# EAGLE design MaxMotornRF52840 (EAGLE 7.7.0)

## Sheet 1 of 2
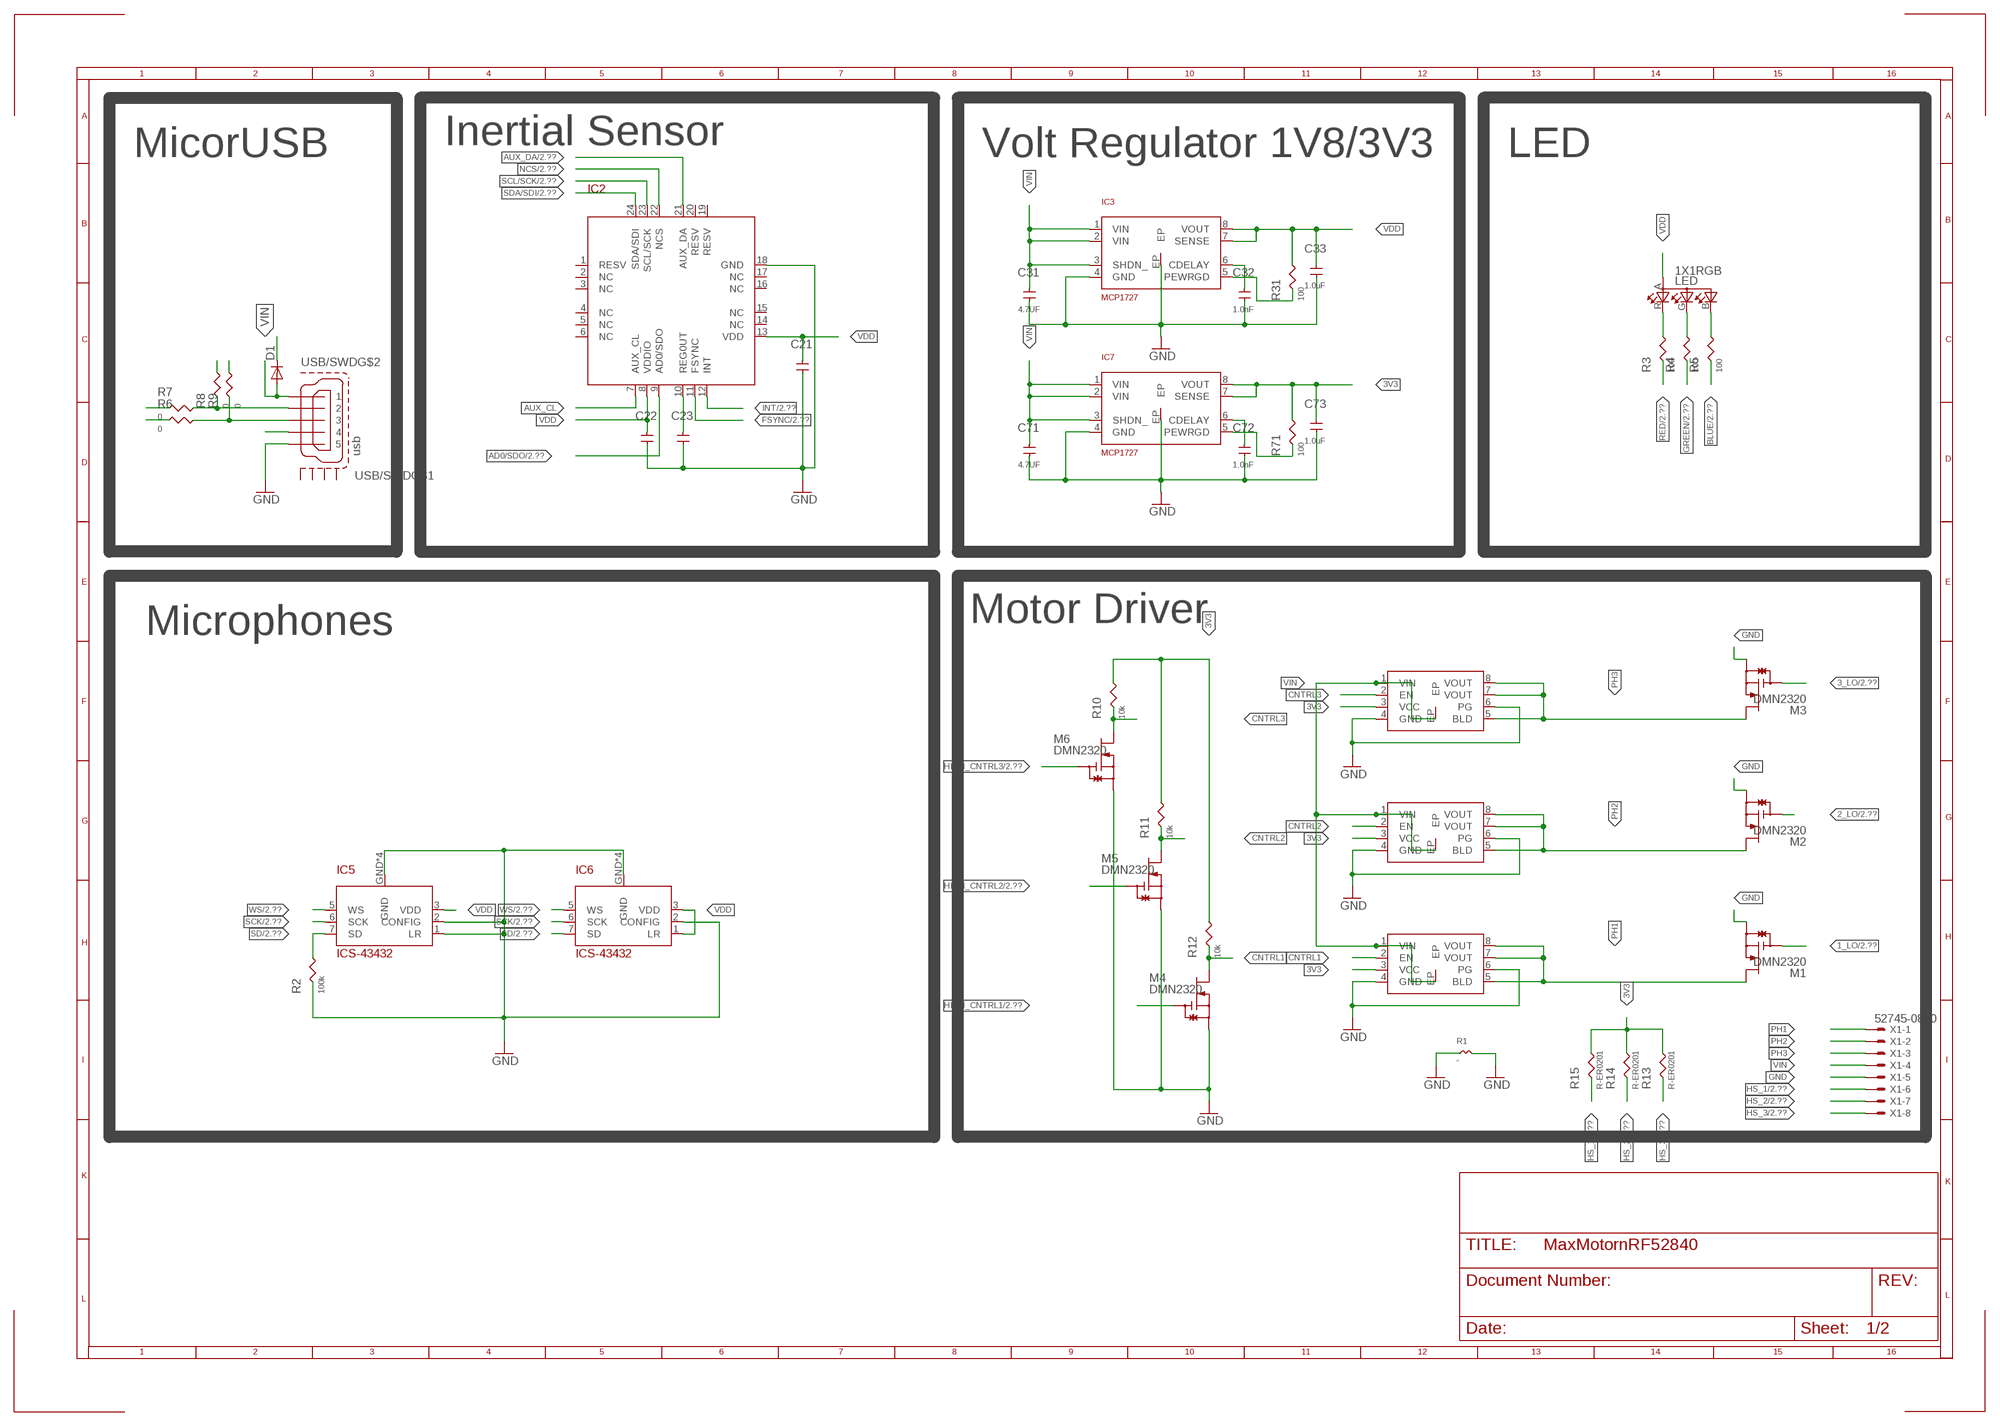
[diagram p0: schematic, sheet 1]

### Parts
C21  C-ER201  [C0201]
C22  C-ER201  [C0201]
C23  C-ER201  [C0201]
C31  4.7UF  C-ERC0402  [C0402]
C32  1.0nF  C-ER201  [C0201]
C33  1.0uF  C-ER201  [C0201]
C71  4.7UF  C-ERC0402  [C0402]
C72  1.0nF  C-ER201  [C0201]
C73  1.0uF  C-ER201  [C0201]
D1  DIODE-SOD123  [SOD123]
IC2  ICM20948  [3X3_24_QFN_CORRECTED]
IC3  MCP1727  [DFN8-3X3]
IC5  ICS-43432  [ICS-43432]
IC6  ICS-43432  [ICS-43432]
IC7  MCP1727  [DFN8-3X3]
LED  1X1RGB  [1X1]
M1  DMN2320  [AP02002]
M2  DMN2320  [AP02002]
M3  DMN2320  [AP02002]
M4  DMN2320  [AP02002]
M5  DMN2320  [AP02002]
M6  DMN2320  [AP02002]
M7  NCP45524/25  [DFN8]
M8  NCP45524/25  [DFN8]
M9  NCP45524/25  [DFN8]
R1  0  R-ER-TINY  [R0805]
R2  100k  R-ER0201  [R0201]
R3  100  R-ER0201  [R0201]
R4  100  R-ER0201  [R0201]
R5  100  R-ER0201  [R0201]
R6  0  R-ER0201  [R0201]
R7  0  R-ER0201  [R0201]
R8  0  R-ER0201  [R0201]
R9  0  R-ER0201  [R0201]
R10  10k  R-ER0201  [R0201]
R11  10k  R-ER0201  [R0201]
R12  10k  R-ER0201  [R0201]
R13  R-ER0201  [R0201]
R14  R-ER0201  [R0201]
R15  R-ER0201  [R0201]
R31  100  R-ER0201  [R0201]
R71  100  R-ER0201  [R0201]
USB/SWD  usb  MICRO-USB-SHIELD-ZX62R-B-5P  [ZX62R-B-5P]
X1  52745-0890  [52745-0890]

### Nets
1_LO: M1.G ; also sheet 2
2_LO: M2.G ; also sheet 2
3_LO: M3.G ; also sheet 2
3V3: C73.2 IC7.7(SENSE) IC7.8(VOUT) M7.3(VCC) M8.3(VCC) M9.3(VCC) R10.2 R11.2 R12.2 R13.2 R14.2 R15.2 R71.2
AD0/SDO: IC2.9(AD0/SDO) ; also sheet 2
AUX_CL: IC2.7(AUX_CL)
AUX_DA: IC2.21(AUX_DA) ; also sheet 2
BLUE: R5.1 ; also sheet 2
CNTRL1: M4.D M7.2(EN) R12.1
CNTRL2: M5.D M8.2(EN) R11.1
CNTRL3: M6.D M9.2(EN) R10.1
D+: R6.1 ; also sheet 2
D-: R7.1 ; also sheet 2
FSYNC: IC2.11(FSYNC) ; also sheet 2
GND: C21.1 C22.1 C23.1 C31.1 C32.1 C33.1 C71.1 C72.1 C73.1 IC2.18(GND) IC3.4(GND) IC3.EP IC5.1(LR) IC5.2(CONFIG) IC5.GND IC5.GND@1(GND) IC5.GND@2(GND) IC5.GND@(GND) IC6.2(CONFIG) IC6.GND IC6.GND@1(GND) IC6.GND@2(GND) IC6.GND@(GND) IC7.4(GND) IC7.EP M1.S M2.S M3.S M4.S M5.S M6.S M7.4(GND) M7.6(PG) M8.4(GND) M8.6(PG) M9.4(GND) M9.6(PG) R1.1 R1.2 R2.1 USB/SWD.1 X1.5 ; also sheet 2
GREEN: R4.1 ; also sheet 2
HIGH_CNTRL1: M4.G ; also sheet 2
HIGH_CNTRL2: M5.G ; also sheet 2
HIGH_CNTRL3: M6.G ; also sheet 2
HS_1: R15.1 X1.6 ; also sheet 2
HS_2: R14.1 X1.7 ; also sheet 2
HS_3: R13.1 X1.8 ; also sheet 2
INT: IC2.12(INT) ; also sheet 2
N$2: C23.2 IC2.10(REG0UT)
N$11: IC7.5(PEWRGD) R71.1
N$13: C72.2 IC7.6(CDELAY)
N$16: LED.B(CGREEN) R5.2
N$24: LED.G(CBLUE) R4.2
N$25: IC3.5(PEWRGD) R31.1
N$26: LED.R(CRED) R3.2
N$27: C32.2 IC3.6(CDELAY)
NCS: IC2.22(NCS) ; also sheet 2
PH1: M1.D M7.5(BLD) M7.7(VOUT) M7.8(VOUT) X1.1
PH2: M2.D M8.5(BLD) M8.7(VOUT) M8.8(VOUT) X1.2
PH3: M3.D M9.5(BLD) M9.7(VOUT) M9.8(VOUT) X1.3
RED: R3.1 ; also sheet 2
SCK: IC5.6(SCK) IC6.6(SCK) ; also sheet 2
SCL/SCK: IC2.23(SCL/SCK) ; also sheet 2
SD: IC5.7(SD) IC6.7(SD) R2.2 ; also sheet 2
SDA/SDI: IC2.24(SDA/SDI) ; also sheet 2
SWDCLK: R9.2 ; also sheet 2
SWDIO: R8.2 ; also sheet 2
USB2: R7.2 R8.1 USB/SWD.4
USB3: R6.2 R9.1 USB/SWD.3
USB4: USB/SWD.2
VBUS: D1.C ; also sheet 2
VDD: C21.2 C22.2 C33.2 IC2.8(VDDIO) IC2.13(VDD) IC3.7(SENSE) IC3.8(VOUT) IC5.3(VDD) IC6.1(LR) IC6.3(VDD) LED.A(A2) R31.2 ; also sheet 2
VIN: C31.2 C71.2 D1.A IC3.1(VIN) IC3.2(VIN) IC3.3(SHDN_) IC7.1(VIN) IC7.2(VIN) IC7.3(SHDN_) M7.1(VIN) M7.EP M8.1(VIN) M8.EP M9.1(VIN) M9.EP USB/SWD.5 X1.4
WS: IC5.5(WS) IC6.5(WS) ; also sheet 2
Unconnected: IC2.1(RESV) IC2.2(NC) IC2.3(NC) IC2.4(NC) IC2.5(NC) IC2.6(NC) IC2.14(NC) IC2.15(NC) IC2.16(NC) IC2.17(NC) IC2.19(RESV) IC2.20(RESV) USB/SWD.M1(S1) USB/SWD.M2(S2) USB/SWD.M3(S3) USB/SWD.M4(S4)

### Notes on the sheet
- MicorUSB | Inertial Sensor | Volt Regulator 1V8/3V3 | LED
- Microphones | Motor Driver

## Sheet 2 of 2
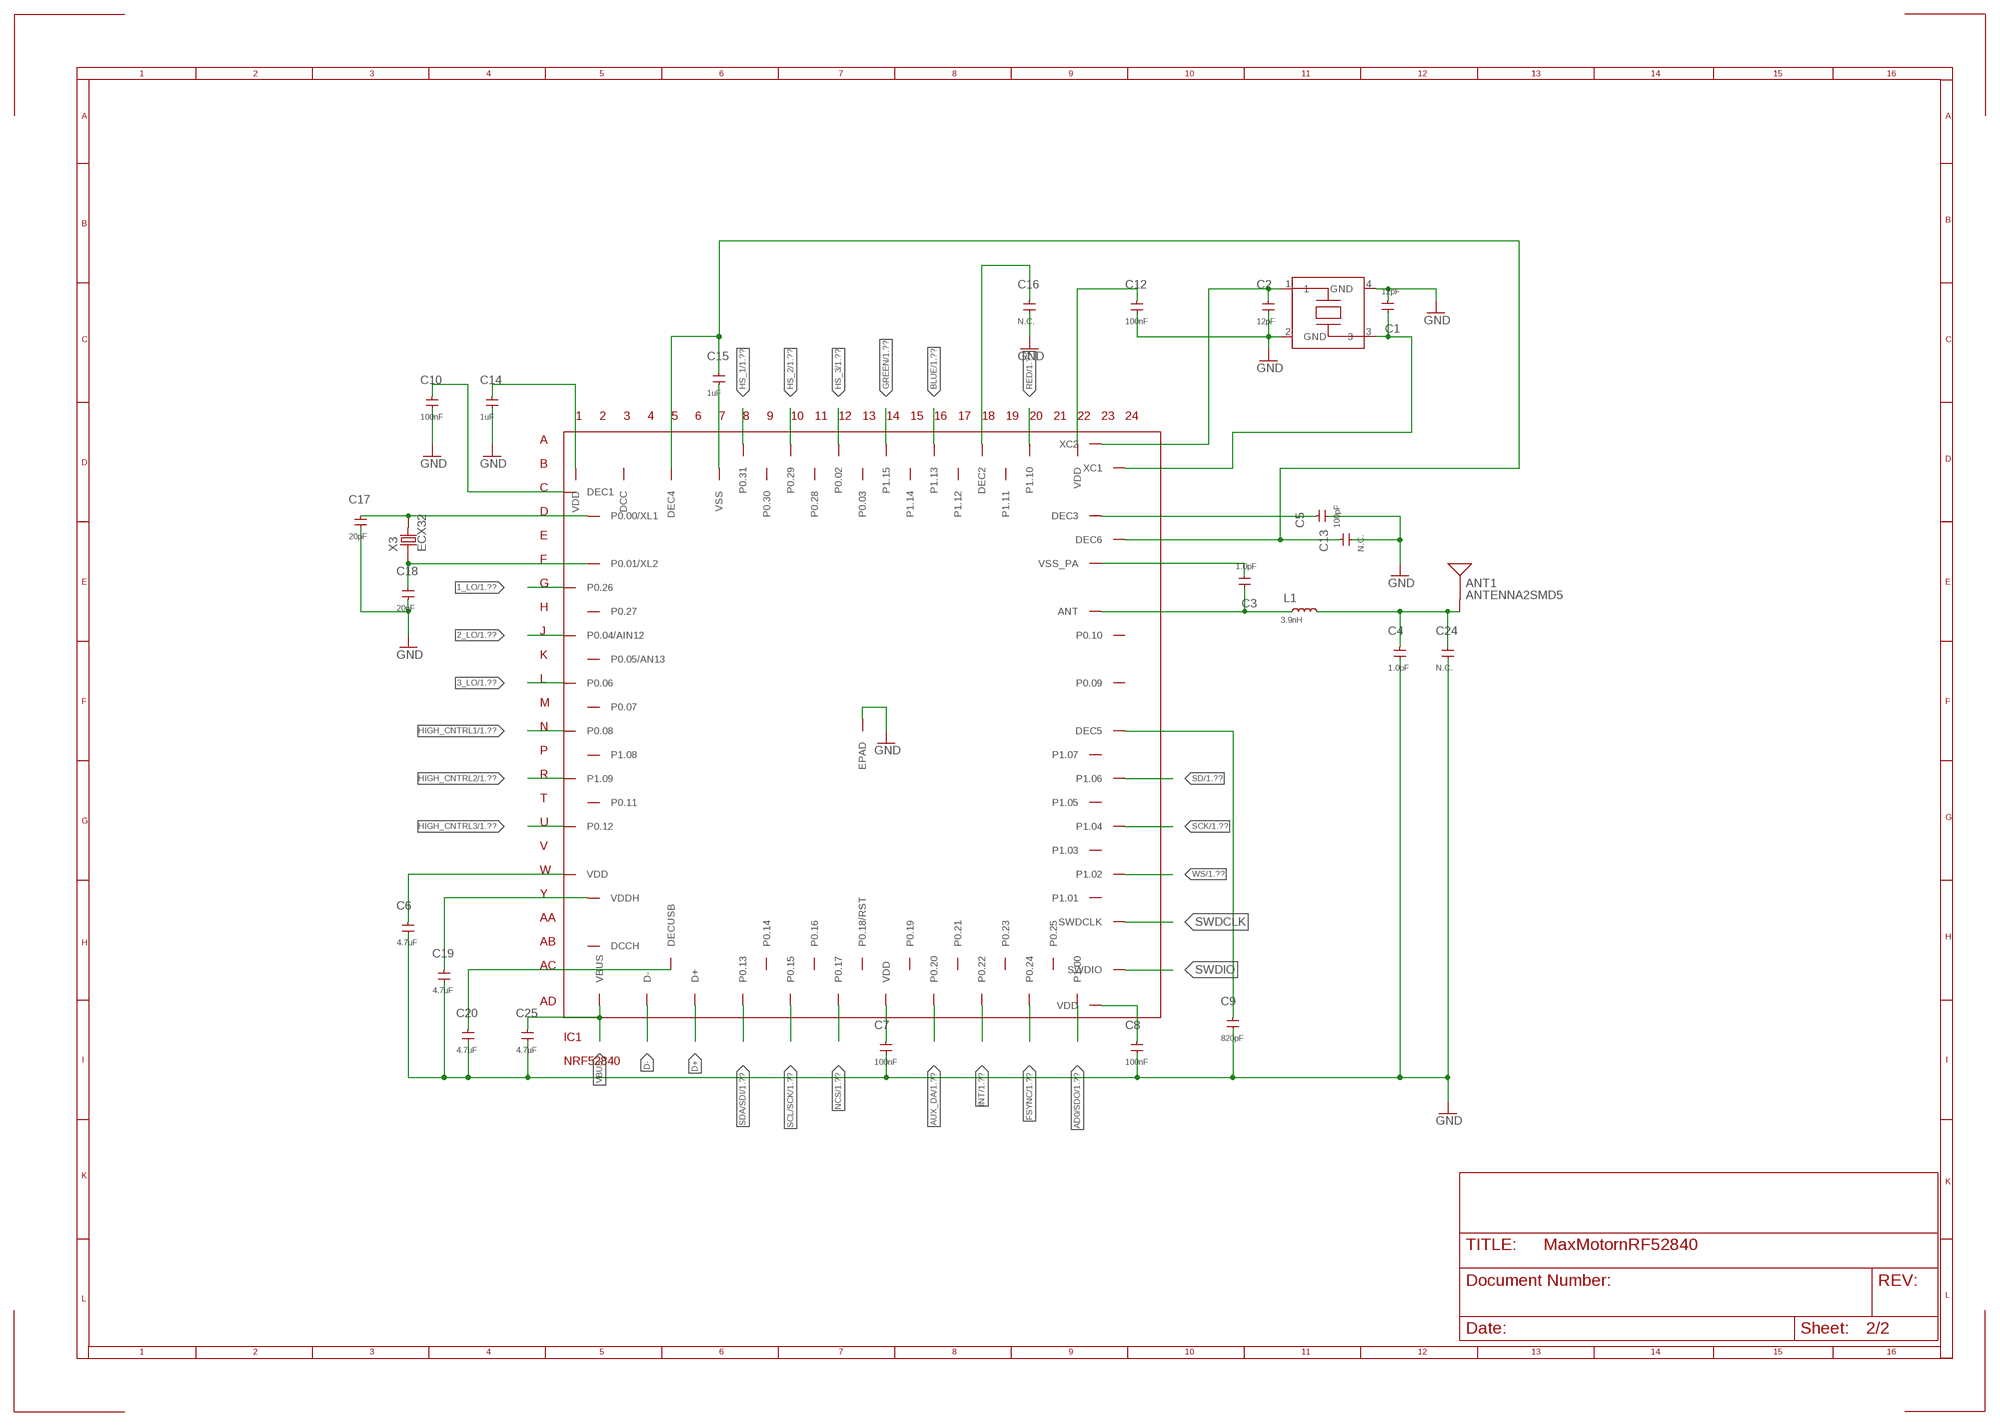
[diagram p1: schematic, sheet 2]

### Parts
ANT1  ANTENNA2SMD5  [ANTENNA-CHIP5]
C1  12pF  C-ER201  [C0201]
C2  12pF  C-ER201  [C0201]
C3  1.0pF  C-ER201  [C0201]
C4  1.0pF  C-ER201  [C0201]
C5  100pF  C-ER201  [C0201]
C6  4.7uF  C-ERC0402  [C0402]
C7  100nF  C-ER201  [C0201]
C8  100nF  C-ER201  [C0201]
C9  820pF  C-ER201  [C0201]
C10  100nF  C-ER201  [C0201]
C12  100nF  C-ER201  [C0201]
C13  N.C.  C-ER201  [C0201]
C14  1uF  C-ER201  [C0201]
C15  1uF  C-ER201  [C0201]
C16  N.C.  C-ER201  [C0201]
C17  20pF  C-ER201  [C0201]
C18  20pF  C-ER201  [C0201]
C19  4.7uF  C-ERC0402  [C0402]
C20  4.7uF  C-ERC0402  [C0402]
C24  N.C.  C-ER201  [C0201]
C25  4.7uF  C-ERC0402  [C0402]
IC1  NRF52840  [AQFN73]
L1  3.9nH  L-ER0201  [C0201@1]
X2  ABM12  [ABM12]
X3  ECX32  [ECX39]

### Nets
1_LO: IC1.G1(P0.26) ; also sheet 1
2_LO: IC1.J1(P0.04/AIN12) ; also sheet 1
3_LO: IC1.L1(P0.06) ; also sheet 1
AD0/SDO: IC1.AD22(P1.00) ; also sheet 1
AUX_DA: IC1.AD16(P0.20) ; also sheet 1
BLUE: IC1.A16(P1.13) ; also sheet 1
D+: IC1.AD6(D+) ; also sheet 1
D-: IC1.AD4(D-) ; also sheet 1
FSYNC: IC1.AD20(P0.24) ; also sheet 1
GND: C1.1 C2.1 C3.1 C4.1 C5.1 C6.1 C7.1 C8.1 C9.1 C10.1 C12.1 C13.1 C14.1 C15.1 C16.1 C17.1 C18.1 C19.1 C20.1 C24.1 C25.1 IC1.B7(VSS) IC1.EPAD IC1.F23(VSS_PA) X2.2(GND) X2.4(GND) ; also sheet 1
GREEN: IC1.A14(P1.15) ; also sheet 1
HIGH_CNTRL1: IC1.N1(P0.08) ; also sheet 1
HIGH_CNTRL2: IC1.R1(P1.09) ; also sheet 1
HIGH_CNTRL3: IC1.U1(P0.12) ; also sheet 1
HS_1: IC1.A8(P0.31) ; also sheet 1
HS_2: IC1.A10(P0.29) ; also sheet 1
HS_3: IC1.A12(P0.02) ; also sheet 1
INT: IC1.AD18(P0.22) ; also sheet 1
N$4: C20.2 IC1.AC5(DECUSB)
N$5: C13.2 C15.2 IC1.B5(DEC4) IC1.E24(DEC6)
N$6: C17.2 IC1.D2(P0.00/XL1) X3.P$2
N$7: C16.2 IC1.A18(DEC2)
N$8: C3.2 IC1.H23(ANT) L1.1
N$9: ANT1.FEED(SIGNAL) C4.2 C24.2 L1.2
N$12: C18.2 IC1.F2(P0.01/XL2) X3.P$1
N$15: C9.2 IC1.N24(DEC5)
N$17: C14.2 IC1.B1(VDD)
N$18: C5.2 IC1.D23(DEC3)
NCS: IC1.AD12(P0.17) ; also sheet 1
RED: IC1.A20(P1.10) ; also sheet 1
SCK: IC1.U24(P1.04) ; also sheet 1
SCL/SCK: IC1.AD10(P0.15) ; also sheet 1
SD: IC1.R24(P1.06) ; also sheet 1
SDA/SDI: IC1.AD8(P0.13) ; also sheet 1
SWDCLK: IC1.AA24(SWDCLK) ; also sheet 1
SWDIO: IC1.AC24(SWDIO) ; also sheet 1
VBUS: C19.2 C25.2 IC1.AD2(VBUS) IC1.Y2(VDDH) ; also sheet 1
VDD: C6.2 C7.2 C8.2 C10.2 C12.2 IC1.A22(VDD) IC1.AD14(VDD) IC1.AD23(VDD) IC1.C1(DEC1) IC1.W1(VDD) ; also sheet 1
WS: IC1.W24(P1.02) ; also sheet 1
XC1: C1.2 IC1.B24(XC1) X2.3
XC2: C2.2 IC1.A23(XC2) X2.1
Unconnected: IC1.AB2(DCCH) IC1.AC9(P0.14) IC1.AC11(P0.16) IC1.AC13(P0.18/RST) IC1.AC15(P0.19) IC1.AC17(P0.21) IC1.AC19(P0.23) IC1.AC21(P0.25) IC1.B3(DCC) IC1.B9(P0.30) IC1.B11(P0.28) IC1.B13(P0.03) IC1.B15(P1.14) IC1.B17(P1.12) IC1.B19(P1.11) IC1.H2(P0.27) IC1.J24(P0.10) IC1.K2(P0.05/AN13) IC1.L24(P0.09) IC1.M2(P0.07) IC1.P2(P1.08) IC1.P23(P1.07) IC1.T2(P0.11) IC1.T23(P1.05) IC1.V23(P1.03) IC1.Y23(P1.01)

## Library data of the parts
ANT1 = SparkFun:ANTENNA2: Antenna Single endded antenna. Common with smaller chip antennas. CHIP4 package is the GPS Chip Antenna SKU: GPS-08418. CHIP5 package is 2.4GHz chip antenna SKU: WRL-00144.
C1-C10 C12-C25 C31-C33 C71-C73 = rcl:C-ER
D1 = diode:DIODE-: DIODE
IC1 = Nordic:NRF52840
IC2 = invensense:ICM20948
IC3 IC7 = microchip:MCP1727
IC5 IC6 = invensense:ICS-43432
L1 = rcl:L-ER
LED = led:1X1RGB
M1-M6 = transistor-fet:DMN2320
M7-M9 = transistor-fet:NCP45524/25
R1 = rcl:R-ER-TINY
R2-R15 R31 R71 = rcl:R-ER
USB/SWD = con-hirose:MICRO-USB-SHIELD-: Hirose Micro USB Connector ZX62R-B-5P: Micro B, reverse (top mount) shell SMT Supplier: DigiKey H11574CT-ND Source: http://www.hirose.co.jp/cataloge_hp/e24200011.pdf
X1 = con-molex:52745-0890: FFC/FPC-to-Board 0.50mm (.020") SMT Top Contact Right Angle, ZIF, Style Receptacle 52745 / 52435 Source: http://www.molex.com/product/ffc/52745.html
X2 = crystal:ABM12; DIGIKEY: SER3800CT-ND
X3 = crystal:ECX32

## Board
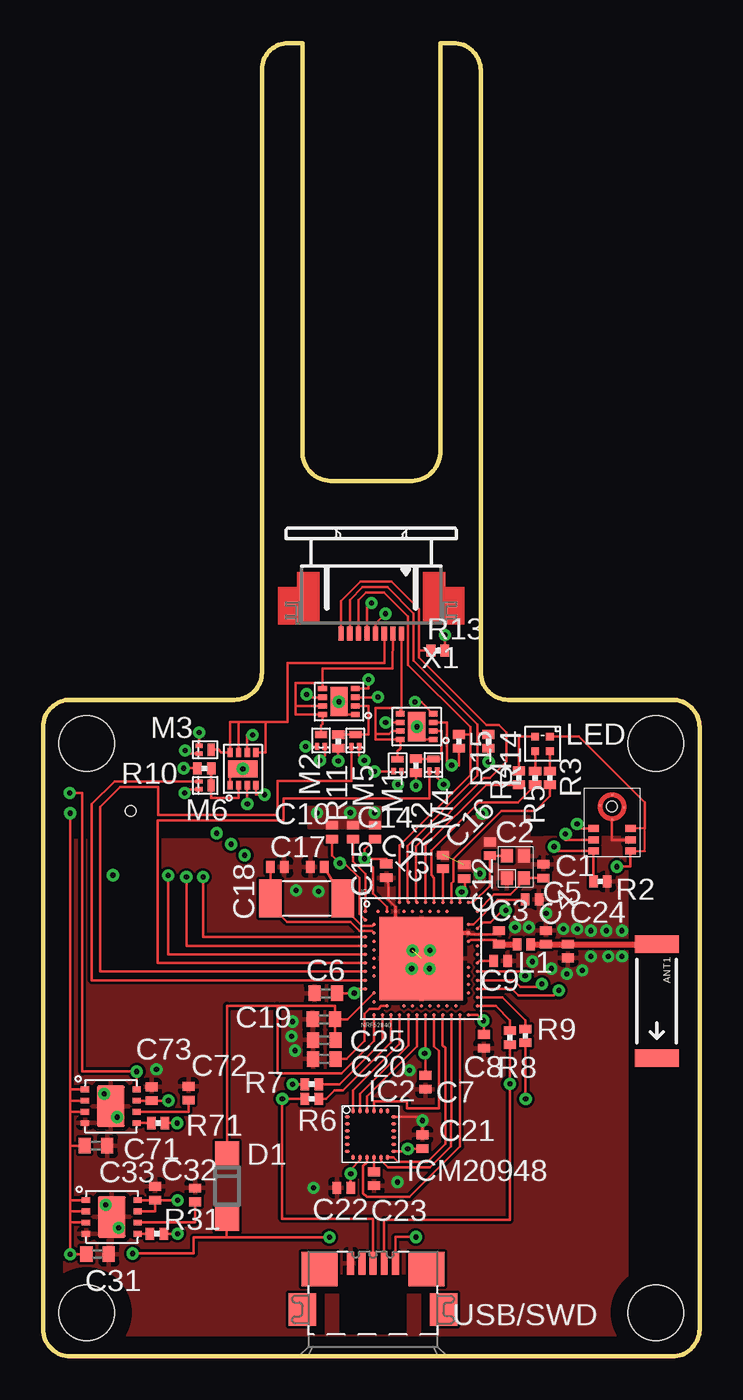
[diagram p2: board, top side]
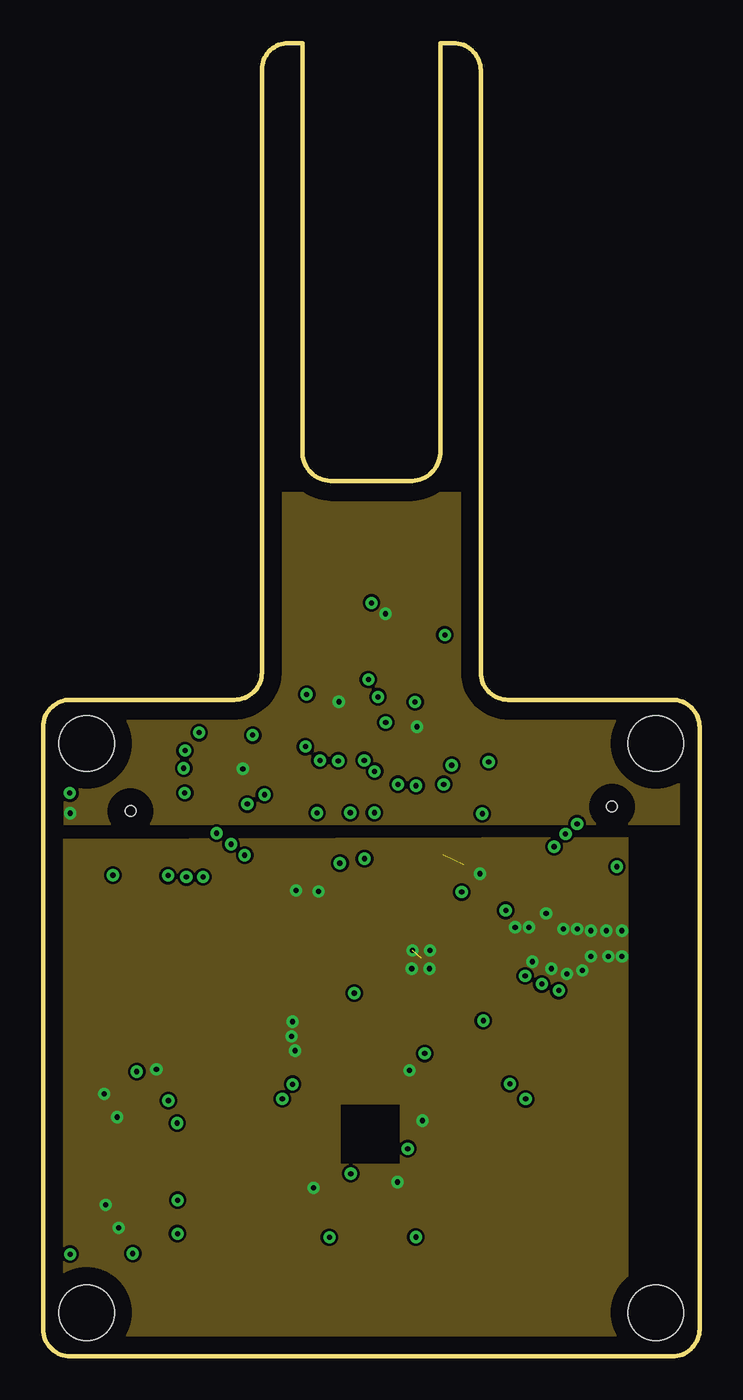
[diagram p3: board, inner layer Route2]
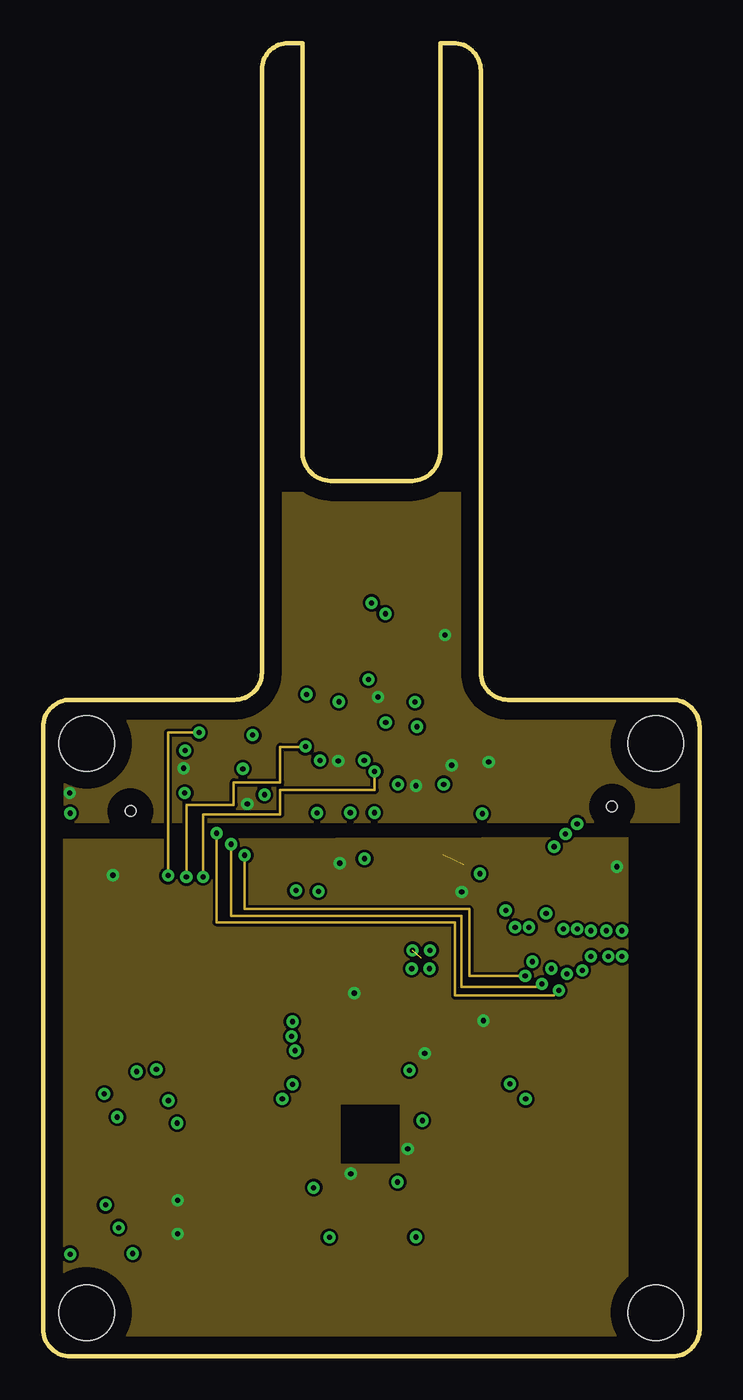
[diagram p4: board, inner layer Route3]
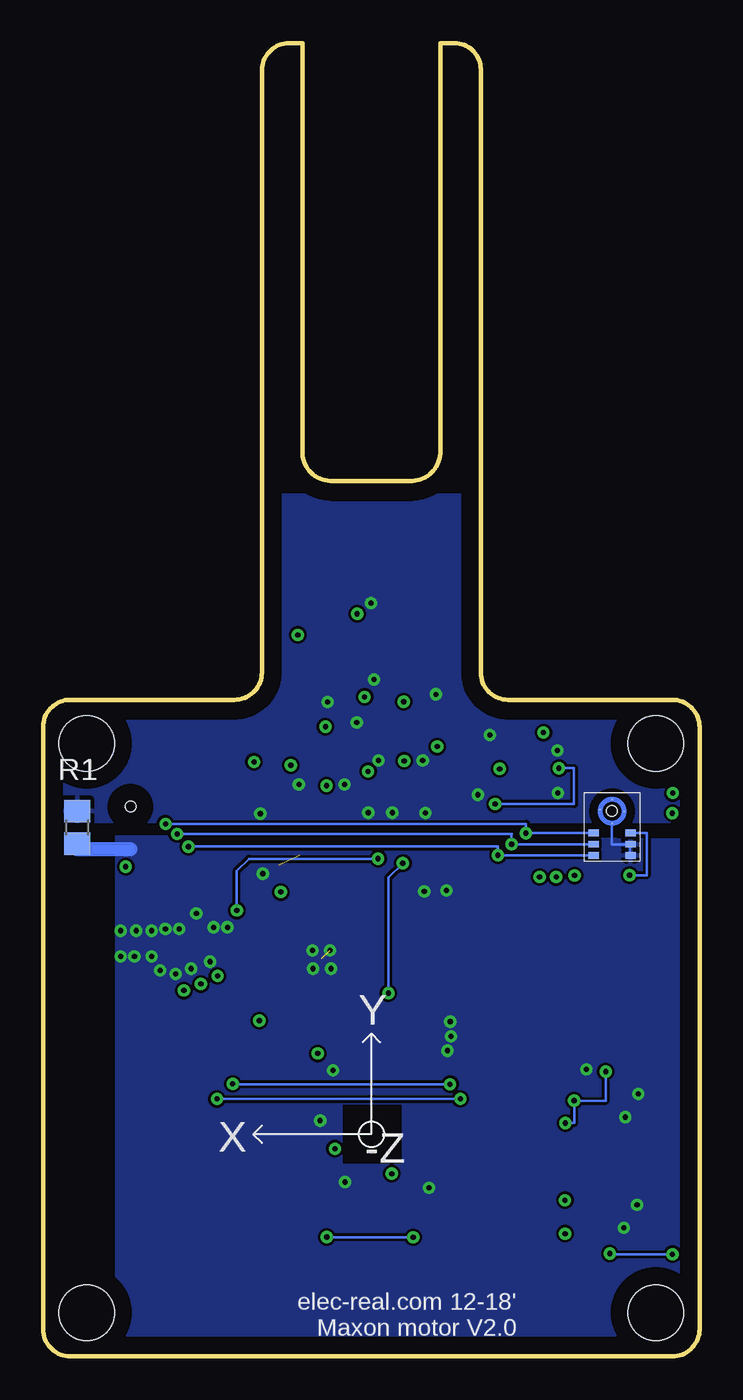
[diagram p5: board, bottom side, seen from below]

Size 38.1 x 76.2 mm. Coordinates in mm from the lower left corner, seen from the top.
Outline: 1.59,0 36.51,0 arc90 38.1,1.59 38.1,36.51 arc90 36.51,38.1 26.99,38.1 arc-90 25.4,39.69 25.4,74.61 arc90 23.81,76.2 23.05,76.2 23.05,52.39 arc-90 21.27,50.8 16.83,50.8 arc-90 15.05,52.39 15.05,76.2 14.22,76.2 arc90 12.7,74.68 12.7,39.69 arc-90 11.11,38.1 1.59,38.1 arc90 0,36.51 0,1.59 arc90 1.59,0
Copper layers (1*2+3*16): Top 0.055mm / dielectric 0.46mm / Route2 0.055mm / dielectric 0.46mm / Route3 0.055mm / dielectric 0.46mm / Bottom 0.055mm
Design rules "default *": minimum track width 5mil, minimum drill 11mil, track to track 6mil, track to pad 6mil, pad to pad 6mil, via to via 6mil, smd to smd 6mil, copper to edge 40mil, drill to drill 8mil, minimum pad ring 10mil, minimum via ring 8mil, stop-mask expansion 4mil, vias tented up to drill 0mil, thermal gap 10mil
Holes 3.2 mm at 2.54,2.54 35.56,2.54 35.56,35.56 2.54,35.56

### Footprints (pad centres in the part's own frame; a part is rotated, then mirrored left to right if it is on the bottom)
ANTENNA-CHIP5 = smd 1.016 x 2.54: FEED -3.302,0; NC 3.302,0
C0201 = smd 0.5 x 0.7: 1 -0.4,0; 2 0.4,0
C0402 = smd 0.7 x 0.9: 1 -0.65,0; 2 0.65,0
SOD123 = smd 1.4 x 1.4: A 1.9,0; C -1.9,0
AQFN73 = smd 0.2 x 0.2: A8 -1.25,3.25; A10 -0.75,3.25; A12 -0.25,3.25; A14 0.25,3.25; A16 0.75,3.25; A18 1.25,3.25; A20 1.75,3.25; A22 2.25,3.25; A23 2.75,3.25; AA24 3.25,-2.25; AB2 -2.75,-2.5; AC5 -2,-2.75; AC9 -1,-2.75; AC11 -0.5,-2.75; AC13 0,-2.75; AC15 0.5,-2.75; AC17 1,-2.75; AC19 1.5,-2.75; AC21 2,-2.75; AC24 3.25,-2.75; AD2 -2.75,-3.25; AD4 -2.25,-3.25; AD6 -1.75,-3.25; AD8 -1.25,-3.25; AD10 -0.75,-3.25; AD12 -0.25,-3.25; AD14 0.25,-3.25; AD16 0.75,-3.25; AD18 1.25,-3.25; AD20 1.75,-3.25; AD22 2.25,-3.25; AD23 2.75,-3.25; B1 -3.25,2.75; B3 -2.5,2.75; B5 -2,2.75; B7 -1.5,2.75; B9 -1,2.75; B11 -0.5,2.75; B13 0,2.75; B15 0.5,2.75; B17 1,2.75; B19 1.5,2.75; B24 3.25,2.75; C1 -3.25,2.25; D2 -2.75,2; D23 2.75,2; E24 3.25,1.75; F2 -2.75,1.5; F23 2.75,1.5; G1 -3.25,1.25; H2 -2.75,1; H23 2.75,1; J1 -3.25,0.75; J24 3.25,0.75; K2 -2.75,0.5; L1 -3.25,0.25; L24 3.25,0.25; M2 -2.75,0; N1 -3.25,-0.25; N24 3.25,-0.25; P2 -2.75,-0.5; P23 2.75,-0.5; R1 -3.25,-0.75; R24 3.25,-0.75; T2 -2.75,-1; T23 2.75,-1; U1 -3.25,-1.25; U24 3.25,-1.25; V23 2.75,-1.5; W1 -3.25,-1.75; W24 3.25,-1.75; Y2 -2.75,-2; Y23 2.75,-2 | smd 4.85 x 4.85: EPAD 0,0
3X3_24_QFN_CORRECTED = smd 0.3 x 0.2: 1 -1.35,1; 2 -1.35,0.6; 3 -1.35,0.2; 4 -1.35,-0.2; 5 -1.35,-0.6; 6 -1.35,-1; 13 1.35,-1; 14 1.35,-0.6; 15 1.35,-0.2; 16 1.35,0.2; 17 1.35,0.6; 18 1.35,1 | smd 0.2 x 0.3: 7 -1,-1.35; 8 -0.6,-1.35; 9 -0.2,-1.35; 10 0.2,-1.35; 11 0.6,-1.35; 12 1,-1.35; 19 1,1.35; 20 0.6,1.35; 21 0.2,1.35; 22 -0.2,1.35; 23 -0.6,1.35; 24 -1,1.35
DFN8-3X3 = smd 0.5 x 0.3: 1 -1.5,0.975; 2 -1.5,0.325; 3 -1.5,-0.325; 4 -1.5,-0.975; 5 1.5,-0.975; 6 1.5,-0.325; 7 1.5,0.325; 8 1.5,0.975 | smd 1.6 x 2.4: EP 0,0
ICS-43432 = smd 0.6 x 0.4: 1 1.075,-0.65; 2 1.075,0; 3 1.075,0.65; 5 -1.075,0.65; 6 -1.075,0; 7 -1.075,-0.65 | smd 0.1 x 0.1: GND 0.7,1.9; GND@ 0,1.2; GND@1 0,2.6; GND@2 -0.7,2 | hole 0.6: 0,1.925
C0201@1 = smd 0.5 x 0.7: 1 -0.4,0; 2 0.4,0
1X1 = smd 0.45 x 0.45: A 0.425,0.425; B -0.425,-0.425; G -0.425,0.425; R 0.425,-0.425
AP02002 = smd 0.4 x 0.7: D 0.35,0 | smd 0.4 x 0.25: G -0.35,0.225; S -0.35,-0.225
DFN8 = smd 0.5 x 0.3: 1 -0.95,0.75; 2 -0.95,0.25; 3 -0.95,-0.25; 4 -0.95,-0.75; 5 0.95,-0.75; 6 0.95,-0.25; 7 0.95,0.25; 8 0.95,0.75 | smd 1 x 1.7: EP 0,0
R0805 = smd 1.3 x 1.5: 1 -0.95,0; 2 0.95,0
R0201 = smd 0.5 x 0.7: 1 -0.4,0; 2 0.4,0
ZX62R-B-5P = smd 1.35 x 0.4: 1 2.675,1.3; 2 2.675,0.65; 3 2.675,0; 4 2.675,-0.65; 5 2.675,-1.3 | smd 1.9 x 1.6: M1 0,-4.1; M2 0,4.1 | smd 2 x 2.1: M3 2.35,3.1; M4 2.35,-3.1
52745-0890 = smd 0.3 x 0.8: 1 -1.75,2.5; 2 -1.25,2.5; 3 -0.75,2.5; 4 -0.25,2.5; 5 0.25,2.5; 6 0.75,2.5; 7 1.25,2.5; 8 1.75,2.5
ABM12 = smd 0.8 x 0.7: 1 -0.65,-0.5; 2 0.65,-0.5; 3 0.65,0.5; 4 -0.65,0.5
ECX39 = smd 1.3 x 2.2: P$1 -2.1,0; P$2 2.1,0

### Placement (x,y rotation side)
ANT1  35.62,20.62 270 top
C1  29.03,28.15 270 top
C2  25.94,29.45 270 top
C3  26.44,24.31 270 top
C4  29.17,24.31 270 top
C5  28.38,26.52 180 top
C6  16.4,21.07 0 top
C7  22.2,15.9 90 top
C8  25.58,18.29 90 top
C9  26.56,22.95 180 top
C10  16.77,30.42 270 top
C12  24.44,28.13 270 top
C13  19.26,30.42 270 top
C14  17.99,30.42 270 top
C15  19.92,28.17 90 top
C16  23.2,28.69 270 top
C17  15.91,28.39 0 top
C18  13.6,28.39 180 top
C19  16.3,19.56 0 top
C20  16.33,17.26 0 top
C21  22.02,12.45 270 top
C22  17.45,9.79 0 top
C23  19.21,10.31 90 top
C24  30.46,23.52 90 top
C25  16.31,18.36 0 top
C31  3.17,5.93 180 top
C32  8.82,9.37 270 top
C33  6.5,9.47 270 top
C71  3.08,12.23 180 top
C72  8.45,15.27 270 top
C73  6.29,15.24 270 top
D1  10.67,9.88 270 top
IC1  21.95,23.08 0 top
IC2  19,12.9 0 top
IC3  3.99,8.09 0 top
IC5  5.08,29.72 0 bottom
IC6  33.02,29.97 0 top
IC7  3.93,14.52 0 top
L1  27.91,23.91 0 top
LED  28.99,35.54 0 top
M1  20.58,34.3 90 top
M2  16.13,35.73 90 top
M3  9.41,35.2 0 top
M4  22.65,34.32 90 top
M5  18.12,35.73 90 top
M6  9.41,33.13 0 top
M7  21.69,36.54 180 top
M8  17.17,37.99 180 top
M9  11.6,34.09 90 top
R1  36.13,30.69 90 bottom
R2  32.34,27.55 180 top
R3  29.42,33.56 90 top
R4  27.62,33.57 90 top
R5  28.56,33.56 90 top
R6  15.6,14.94 180 top
R7  15.6,15.79 180 top
R8  27.1,18.5 90 top
R9  28,18.6 90 top
R10  9.36,34.11 180 top
R11  17.13,35.68 270 top
R12  21.64,34.27 270 top
R13  22.91,40.94 0 top
R14  25.86,35.69 270 top
R15  24.13,35.69 270 top
R31  6.61,7.13 0 top
R71  6.68,13.54 0 top
USB/SWD  19.15,2.72 90 top
X1  19.05,44.45 180 top
X2  27.42,28.4 270 top
X3  15.29,26.58 0 top

### Tracks (layer width: path | path; a pad name or v marks a point on that pad's centre or on a via)
1_LO  (via drill 0.3)
  Top 0.152: IC1.G1 9.28,24.33 v9.28,27.82 | M1.G v19.24,33.95
  Route3 0.152: v9.28,27.82 9.28,31.45 13.77,31.45 13.77,32.86 19.24,32.86 v19.24,33.95
2_LO  (via drill 0.3)
  Top 0.152: IC1.J1 8.32,23.83 v8.32,27.81 | v15.23,35.38 M2.G
  Route3 0.152: v8.32,27.81 8.32,32.01 11.07,32.01 11.07,33.31 13.77,33.31 13.77,35.37 v15.23,35.37 v15.23,35.38
3_LO  (via drill 0.3)
  Top 0.152: IC1.L1 7.25,23.33 v7.25,27.9 | v9.06,36.2 M3.G
  Route3 0.152: v7.25,27.9 7.25,36.2 v9.06,36.2
3V3  (via drill 0.3)
  Top 0.152: R12.2 v21.64,33.12 v21.65,33.11 | R11.2 v17.13,34.56 v17.14,34.55 | M8.3 19.44,38.24 v19.44,38.26 | M9.3 11.85,32.2 v11.86,32.05 | IC7.7 C73.2 v7.28,14.84 v7.28,14.83 | IC7.8 v5.43,16.53 v5.44,16.53 2.27,16.53 2.27,32.69 v1.55,32.69 | R71.2 v7.78,13.54 | R10.2 8.96,34.13 v8.16,34.13 | M7.3 23.45,36.79 23.45,34.3 v23.72,34.3 24.13,34.3 R15.2 | R13.2 v23.31,41.85 v23.32,41.86 | R14.2 v25.86,34.49
  Bottom 0.152: v5.44,16.53 IC7.7 v7.28,14.84 7.28,13.54 v7.78,13.54 | v8.16,34.13 7.29,34.13 7.29,32.05 v11.86,32.05
  pour Route3: 1.2,31 36.9,31 36.9,36.9 36.9,50.1 11.8,50.1 1.2,50.1
AD0/SDO
  Top 0.152: IC2.9 18.8,11.26 18.58,11.04 18.58,9.47 18.81,9.24 21.27,9.24 24.2,12.18 IC1.AD22
AUX_DA
  Top 0.152: IC2.21 19.2,14.81 21.11,14.81 21.11,14.4 22.97,14.4 22.97,17.73 22.69,18 IC1.AD16
BLUE
  Top 0.152: R5.1 27.55,32.15 25.31,32.15 22.53,29.37 22.53,27.93 22.7,27.76 IC1.A16
CNTRL1
  Top 0.152: R12.1 M4.D 23.13,34.67 23.13,36.29 M7.2
CNTRL2
  Top 0.152: R11.1 M5.D 18.89,36.08 18.89,37.74 M8.2
CNTRL3
  Top 0.152: R10.1 M6.D 9.76,32.39 11.35,32.39 M9.2
D+
  Top 0.152: R6.1 16.43,14.94 16.93,15.43 17.42,15.43 20.2,18.21 IC1.AD6
D-
  Top 0.152: R7.1 17.21,15.79 19.7,18.28 IC1.AD4
FSYNC
  Top 0.152: IC2.11 19.6,11.39 20.02,10.96 22.45,10.96 23.68,12.2 23.68,13.52 23.7,13.54 IC1.AD20
GND  (via drill 0.3)  (2 unrouted)
  Top 0.152: IC1.F23 24.83,24.48 26.21,24.48 arc90 C3.1 | C15.1 20.05,27.39 20.05,26.48 20.45,26.08 IC1.B7 20.45,24.55 v21.44,23.56 | C21.1 22.02,13.54 v22.02,13.68 21.79,13.9 IC2.18 | IC6.2 33.02,29.97 IC6.GND@ arc90 IC6.GND arc90 IC6.GND@1 32.92,32.57 arc90 IC6.GND@2 | M7.6 v19.89,36.79 v19.89,36.78 | M9.6 11.85,36.05 v12.17,36.05 | M1.S 20.8,33.39 v20.6,33.19 | M4.S 22.88,33.57 v23.25,33.19 | M5.S 18.35,34.88 v18.64,34.59 | M2.S 16.35,34.87 v16.07,34.59 | M8.4 18.89,38.74 v18.89,39.27 | M8.6 15.29,38.24 v15.29,38.41 | M9.4 12.35,32.59 v12.85,32.59 | M3.S 8.24,34.98 v8.24,35.15 | M6.S 8.23,32.91 v8.22,32.69 | X1.5 18.8,43.46 v19.06,43.72 | M7.4 21.96,37.97 v21.59,37.97
  Top 0.254: IC1.F23 23.45,24.58 IC1.EPAD
  Bottom 0.127: IC5.1 IC5.2
  Bottom 0.152: IC5.GND@2 arc90 5.18,32.32 IC5.GND@1 arc90 IC5.GND arc90 IC5.GND@ 5.08,29.72 IC5.2
  Bottom 0.813: R1.1 36.13,29.43 33.03,29.43
  other vias: 22.46,23.56 21.39,22.49 22.43,22.49 27.4,24.9 28.2,24.9 29.2,25.7 30.2,24.8 31,24.8 31.8,24.7 32.7,24.7 33.6,24.7 33.6,23.2 32.8,23.2 31.8,23.2 31.3,22.4 30.4,22.2 29.5,22.5 28.4,22.9 3.63,8.79 4.39,7.47 3.55,15.23 4.31,13.89 14.47,19.43 14.43,18.56 14.63,17.74 20.58,10.11 21.26,16.6 6.58,16.65 15.9,31.54 17.83,31.55 19.23,31.55 14.68,27.03 15.98,26.98 15.7,9.79 25.35,28.01 25.49,31.49
  pour Top (no thermals): 23.16,31.33 23.16,27.79 28.24,27.79 28.24,31.33
  pour Top (no thermals): 15.41,31.87 15.41,30.66 19.6,30.66 19.6,31.87
  pour Bottom: 0,0 0,30 33.9,30.2 33.9,0.2
  pour Route2: 0,0 0,30 33.9,30.1 33.9,0.1
  pour Top: 0,0 0,30 33.9,30.2 33.9,0.2
  pour Bottom: 0,31 0,50 30.6,50 38.1,50 38.1,35.5 38.1,31
GREEN
  Top 0.152: R4.1 25.73,33.17 22.2,29.64 IC1.A14
HIGH_CNTRL1
  Top 0.152: IC1.N1 6.66,22.83 6.66,31.1 13.96,31.1 13.96,32.36 22.43,32.36 M4.G
HIGH_CNTRL2
  Top 0.152: IC1.R1 3.32,22.33 3.32,31.89 4.47,33.05 6.67,33.05 6.67,33.02 6.67,32.87 6.67,31.41 13.61,31.41 13.61,33.39 17.9,33.39 M5.G
HIGH_CNTRL3
  Top 0.152: IC1.U1 2.83,21.83 2.83,32.05 4.14,33.35 M6.G
HS_1
  Top 0.152: X1.6 18.3,43.88 18.75,44.33 19.78,44.33 21.19,42.92 21.19,40.13 24.79,36.52 24.79,36.07 | IC1.A8 20.7,29.65 24.79,33.74 24.79,36.07 | R15.1 24.77,36.09 24.79,36.07
HS_2
  Top 0.152: X1.7 17.8,43.9 18.54,44.64 19.99,44.64 21.5,43.11 21.5,40.38 25.22,36.66 25.22,36.14 | IC1.A10 21.14,26.39 21.14,29.61 25.22,33.69 25.22,36.14 | R14.1 25.86,36.14 25.22,36.14
HS_3
  Top 0.152: X1.8 17.3,43.84 18.42,44.96 20.23,44.96 21.82,43.37 21.82,40.97 | IC1.A12 21.63,26.4 21.63,29.6 25.58,33.55 25.93,33.55 26.9,34.52 26.9,36.2 26.47,36.63 25.74,36.63 21.82,40.55 21.82,40.97 | R13.1 21.84,40.95 21.82,40.97
INT
  Top 0.152: IC2.12 20.35,11.55 20.61,11.29 22.3,11.29 23.34,12.33 23.34,17.91 23.19,18.06 23.19,19.82 IC1.AD18
N$1
  cutout Top: 25.37,24.56 27.08,24.56 27.08,25.37 26.52,25.37 25.91,24.77 25.58,24.77 25.4,24.59
N$2
  Top 0.152: IC2.10 19.21,11.54 C23.2
N$4
  Top 0.152: IC1.AC5 19.61,20.33 19.46,20.18 18.96,20.18 18.66,19.88 18.66,18.32 17.6,17.26 C20.2
N$5  (via drill 0.3)
  Top 0.152: IC1.B5 19.95,26.08 19.16,26.88 19.16,28.38 v18.66,28.88 | v18.66,28.88 18.66,29.42 C13.2 | IC1.E24 25.55,25.18 25.96,25.18 26.66,25.88 v26.86,25.88 | C15.2 19.92,28.88 v18.66,28.88
  Bottom 0.152: v26.86,25.88 26.86,28.18 26.16,28.88 v18.66,28.88
N$6
  Top 0.152: IC1.D2 19.13,24.98 18.52,24.98 17.39,26.11 X3.P$2 C17.2
N$7
  Top 0.152: IC1.A18 C16.2
N$8
  Top 0.152: IC1.H23 24.83,24.17 26.19,24.17 arc-90 C3.2
  Top 0.356: C3.2 L1.1
  Top 0.406: C3.2
N$9
  Top 0.356: L1.2 C4.2 C24.2 35.74,23.92 ANT1.FEED
  Top 1.016: 35.74,23.91 ANT1.FEED
N$11
  Top 0.152: IC7.5 R71.1
N$12
  Top 0.152: IC1.F2 19.1,24.68 18.37,24.68 17.83,25.21 14.15,25.21 13.77,25.59 13.77,26.01 X3.P$1 C18.2
N$13
  Top 0.152: IC7.6 8.45,14.19 C72.2
N$14
  cutout Bottom: 17.3,14.5 17.3,11.2 20.7,11.2 20.7,14.6 17.4,14.6 17.3,14.6
N$15
  Top 0.152: IC1.N24 25.32,22.95 C9.2
N$16
  Top 0.152: R5.2 LED.B
N$17
  Top 0.152: IC1.B1 18.7,28 17.99,28.72 C14.2
N$18
  Top 0.152: IC1.D23 24.97,25.08 26.37,26.48 27.94,26.48 arc90 C5.2
N$19
  cutout Top: 17.3,14.6 20.7,14.6 20.7,13.2 20.7,11.2 17.6,11.2 17.3,11.2
N$20
  cutout Route2: 17.3,14.6 20.7,14.6 20.7,11.2 17.3,11.2
N$21
  cutout Route3: 17.3,14.6 20.7,14.6 20.7,11.2 17.3,11.2
N$24
  Top 0.152: LED.G 27.62,35.96 R4.2
N$25
  Top 0.152: IC3.5 6.21,7.12 R31.1
N$26
  Top 0.152: R3.2 LED.R
N$27
  Top 0.152: IC3.6 8.82,7.77 C32.2
NCS
  Top 0.152: IC2.22 18.8,15.08 21.7,17.98 IC1.AD12
PH1
  Top 0.152: M7.5 | M7.7 20.25,36.29 20.09,36.13 19.3,36.13 | 19.3,36.13 19.3,35.8 M7.8 20.73,35.27 20.58,35.12 M1.D | 19.3,36.13 19.3,37.62 20.74,37.62 M7.5 | 20.81,41.95 X1.1 20.8,37.29 M7.5
PH2
  Top 0.152: 14.64,37.74 14.64,37.24 M8.8 16.22,36.7 16.13,36.6 M2.D | 14.64,37.74 14.64,39.06 16.22,39.06 | 16.22,39.06 M8.5 | M8.7 14.64,37.74 | 16.22,39.06 16.21,39.92 20.29,39.92 X1.2
PH3
  Top 0.152: 11.35,36.8 10.85,36.8 M9.8 10.34,35.04 10.18,35.2 M3.D | 11.35,36.8 12.92,36.8 | 12.92,36.8 12.92,35.03 12.35,35.03 M9.5 | M9.7 11.35,36.8 | X1.3 19.81,40.24 14.2,40.24 14.2,36.8 12.92,36.8
RED
  Top 0.152: IC1.A20 23.7,27.44 23.81,27.55 23.81,28.85 26.61,31.65 28.56,31.65 29.42,32.51 R3.1
SCK  (via drill 0.3)
  Top 0.152: IC1.U24 27.33,21.83 27.71,21.45 28.78,21.45 v28.94,21.61 | IC6.6 30.32,29.97 v30.32,30.31
  Route3 0.152: v10.9,29.72 10.9,25.56 24.27,25.56 24.27,21.45 28.78,21.45 v28.94,21.61
  Bottom 0.152: IC5.6 v10.9,29.72 10.9,30.31 v30.32,30.31
SCL/SCK
  Top 0.152: IC2.23 18.4,15.24 21.2,18.04 IC1.AD10
SD  (via drill 0.3)
  Top 0.152: IC1.R24 27.73,22.33 v27.98,22.08 | v29.66,29.58 29.66,29.32 IC6.7 arc90 IC6.7 R2.2
  Route3 0.152: v27.98,22.08 24.74,22.08 24.74,25.95 11.7,25.95 v11.7,29.08
  Bottom 0.152: v29.66,29.58 11.7,29.58 v11.7,29.08 11.7,29.07 IC5.7
SDA/SDI
  Top 0.152: IC2.24 18,15.43 20.7,18.13 IC1.AD8
SWDCLK
  Top 0.152: IC1.AA24 26.67,20.83 28,19.5 R9.2
SWDIO
  Top 0.152: IC1.AC24 26.27,20.33 27.1,19.5 R8.2
USB2  (via drill 0.3)
  Top 0.152: USB/SWD.4 19.8,7.91 27.09,7.91 v27.09,15.81 27.1,16.96 R8.1 | R7.2 v14.48,15.79
  Bottom 0.152: v14.48,15.79 27.09,15.79 v27.09,15.81
USB3  (via drill 0.3)
  Top 0.152: USB/SWD.3 19.15,8 13.88,8 v13.88,14.94 R6.2 | R9.1 v28,14.94
  Bottom 0.152: v28,14.94 v13.88,14.94
VBUS
  Top 0.152: IC1.Y2 17.68,19.56 C19.2 | C25.2 C19.2 | IC1.AD2 19.2,18.32 17.31,16.43 13.6,16.43 13.6,20.35 | 13.6,20.35 16.95,20.35 C19.2 | D1.C 10.67,20.35 13.6,20.35
VDD  (via drill 0.3, 0.33)
  Top 0.127: IC6.1 34.92,29.32 34.92,30.62 IC6.3
  Top 0.152: IC1.C1 18.37,25.66 18.37,27.75 17.5,28.62 v17.23,28.62 16.77,29.07 C10.2 | IC1.W1 18.31,21.33 v18.05,21.08 C6.2 | IC1.AD14 22.2,17.62 v22.16,17.58 22.2,17.53 C7.2 | IC1.AD23 25.2,19.83 v25.55,19.48 25.58,19.45 C8.2 | IC1.A22 24.2,26.83 v24.3,26.95 24.5,27.15 C12.2 | R31.2 v7.8,7.13 v7.8,7.12 | C33.2 v7.81,9.07 v7.81,9.06 | IC3.7 6.5,8.42 C33.2 | IC3.8 C33.2 | IC2.13 21.01,11.9 v21.16,12.05 C21.2 | IC2.8 18.4,11.4 17.86,10.86 v17.86,10.6 v17.85,10.59 C22.2 | IC6.1 34.09,28.42 v33.3,28.42 | LED.A 31.09,35.96 34.92,32.13 34.92,30.62
  Bottom 0.152: IC5.3 3.07,30.37 3.07,27.92 v4.06,27.92 | v18.05,21.08 18.05,27.79 v17.23,28.62
  pour Route3: 0,0 0,30 33.9,30.1 33.9,0.1
VIN  (via drill 0.3)
  Top 0.152: M9.1 10.85,34.09 M9.EP | M7.1 21.71,35.79 v21.71,36.53 v21.7,36.54 M7.EP | M8.1 17.17,37.24 v17.17,37.98 M8.EP | 1.57,7.77 v1.57,5.93 C31.2 v1.57,5.93 | 1.57,7.77 1.57,8.42 | 1.57,8.42 1.57,9.07 | 1.57,9.07 1.57,12.23 | 1.57,12.23 1.57,14.19 | 1.57,14.19 1.57,14.84 | 1.57,14.84 1.57,15.49 | 1.57,15.49 v1.57,31.52 | IC3.3 1.57,7.77 | IC3.2 1.57,8.42 | IC3.1 1.57,9.07 | IC7.1 1.57,15.49 | IC7.2 1.57,14.84 | IC7.3 1.57,14.19 | C71.2 1.57,12.23 | USB/SWD.5 20.45,6.93 v21.64,6.93 | 10.65,6.91 8.75,6.91 8.75,5.97 v5.21,5.97 | 10.65,6.91 v16.62,6.91 | D1.A 10.65,7.98 10.65,6.91 | X1.4 19.3,42.52 v19.87,43.09
  Bottom 0.152: v16.62,6.91 21.64,6.91 v21.64,6.93 | v5.21,5.97 5.21,5.93 v1.57,5.93
  other vias: 11.6,34.09
  pour Route2: 1.2,30.9 37,30.9 37,44.1 37,50.1 9.7,50.1 1.2,50.1
WS  (via drill 0.3)
  Top 0.152: IC1.W24 27.21,21.33 27.59,20.94 29.64,20.94 v29.93,21.23 | IC6.5 30.99,30.62 v30.99,30.9
  Route3 0.152: v10.07,30.36 10.07,25.19 23.91,25.19 23.91,20.94 29.64,20.94 v29.93,21.23
  Bottom 0.152: IC5.5 v10.06,30.37 v10.07,30.36 10.07,30.9 v30.99,30.9
XC1
  Top 0.152: IC1.B24 26.17,26.8 27.12,26.8 27.91,27.59 X2.3 C1.2
XC2
  Top 0.152: IC1.A23 24.96,26.33 25.94,27.31 C2.2 X2.1

### Text on the board
bPlace: Y | X | -Z | elec-real.com 12-18' / Maxon motor V2.0